# Altium project BoardCongSuat.PrjPcb
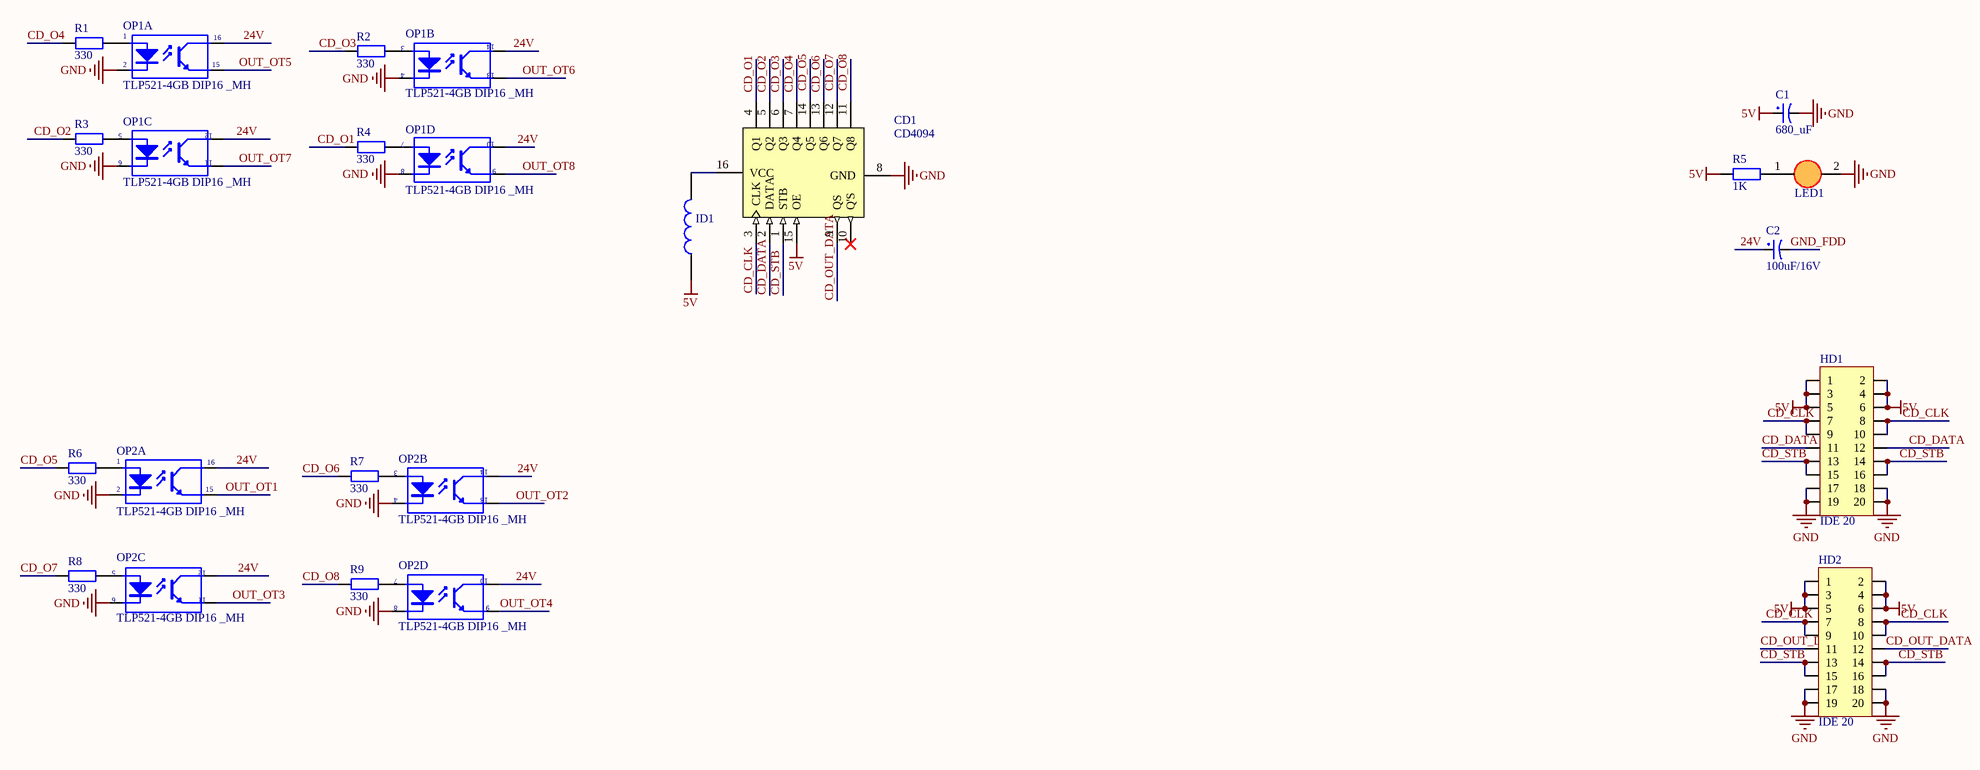
[diagram p0: CongSuat_SCH.SchDoc]
2 sheets, 87 parts. Net scope: global (net labels, ports and power ports of the same name join across sheets).
Board file: CS_PCB.PcbDoc
Sheets:
  CongSuat_SCH.SchDoc
  relay.SchDoc

## Sheet CongSuat_SCH.SchDoc
size A3

### Parts
C1  680_uF  [TU_HOA(100uF/35V - 470uF/16V)]
C2  100uF/16V  [TU_HOA(100uF/35V - 470uF/16V)]
CD1  CD4094  [DIP16]
HD1  IDE 20  [CABLE 20]
HD2  IDE 20  [CABLE 20]
ID1  Inductor 0805_MH  [TU_SMD_0805]  (value not drawn)
LED1  LED3  [LED 3mm Do]  (value not drawn)
OP1  TLP521-4GB DIP16 _MH  [DIP16]  (parts A,B,C,D of 4)
OP2  TLP521-4GB DIP16 _MH  [DIP16]  (parts A,B,C,D of 4)
R1  330  [Tro SMD 0805]
R2  330  [Tro SMD 0805]
R3  330  [Tro SMD 0805]
R4  330  [Tro SMD 0805]
R5  1K  [Tro SMD 0805]
R6  330  [Tro SMD 0805]
R7  330  [Tro SMD 0805]
R8  330  [Tro SMD 0805]
R9  330  [Tro SMD 0805]

### Nets
5V: C1.1 CD1.15(OE) HD1.1 HD1.2 HD1.3 HD1.4 HD1.5 HD1.6 HD2.1 HD2.2 HD2.3 HD2.4 HD2.5 HD2.6 ID1.1 R5.1
GND: C1.2 CD1.8(GND) HD1.17 HD1.18 HD1.19 HD1.20 HD2.17 HD2.18 HD2.19 HD2.20 LED1.2(K) OP1.2(K) OP1.4(K) OP1.6(K) OP1.8(K) OP2.2(K) OP2.4(K) OP2.6(K) OP2.8(K)
GND_FDD: C2.2
24V: C2.1 OP1.10(C) OP1.12(C) OP1.14(C) OP1.16(C) OP2.10(C) OP2.12(C) OP2.14(C) OP2.16(C)
CD_CLK: CD1.3(CLK) HD1.7 HD1.8 HD1.9 HD1.10 HD2.7 HD2.8 HD2.9 HD2.10
CD_DATA: CD1.2(DATA) HD1.11 HD1.12
CD_O1: CD1.4(Q1) R4.1
CD_O2: CD1.5(Q2) R3.1
CD_O3: CD1.6(Q3) R2.1
CD_O4: CD1.7(Q4) R1.1
CD_O5: CD1.14(Q5) R6.1
CD_O6: CD1.13(Q6) R7.1
CD_O7: CD1.12(Q7) R8.1
CD_O8: CD1.11(Q8) R9.1
CD_OUT_DATA: CD1.9(QS) HD2.11 HD2.12
CD_STB: CD1.1(STB) HD1.13 HD1.14 HD1.15 HD1.16 HD2.13 HD2.14 HD2.15 HD2.16
OUT_OT1: OP2.15(E)
OUT_OT2: OP2.13(E)
OUT_OT3: OP2.11(E)
OUT_OT4: OP2.9(E)
OUT_OT5: OP1.15(E)
OUT_OT6: OP1.13(E)
OUT_OT7: OP1.11(E)
OUT_OT8: OP1.9(E)
NetCD1_16: CD1.16(VCC) ID1.2
NetLED1_1: LED1.1(A) R5.2
NetOP1_1: OP1.1(A) R1.2
NetOP1_3: OP1.3(A) R2.2
NetOP1_5: OP1.5(A) R3.2
NetOP1_7: OP1.7(A) R4.2
NetOP2_1: OP2.1(A) R6.2
NetOP2_3: OP2.3(A) R7.2
NetOP2_5: OP2.5(A) R8.2
NetOP2_7: OP2.7(A) R9.2

Not connected (* = marked no-connect by the designer): CD1 10(Q'S)*

### Notes on the sheet
- Title
- Size:
- Date:
- A3
- Number:
- Time:
- Revision:
- Sheet
- of
- File:

### Library data of the parts
C1 = TU_HOA_680_uF_25V_MH: TU_HOA_680_uF_25V; Value: 100uF/35V/50V; Description 1: 1000uF/6,3V - 470uF/16V - 330uF - 25V; Description 2: 220uF/35V - 100uF/50V - 63V - 4,7uF/200V; Description 3: 22uF => 33uF100V - 3,3uF => 4,7uF/250V; Description 4: 2,2uF =>3,3uF/350 - 2,2uF/400V - 1uF/450V
C2 = TU_HOA_100uF_50V_MH: TU_HOA_100uF_50V; Value: 100uF/35V/50V; Description 1: 1000uF/6,3V - 470uF/16V - 330uF - 25V; Description 2: 220uF/35V - 100uF/50V - 63V - 4,7uF/200V; Description 3: 22uF => 33uF100V - 3,3uF => 4,7uF/250V; Description 4: 2,2uF =>3,3uF/350 - 2,2uF/400V - 1uF/450V
HD1 HD2 = IDE 20: IDE header 20P
ID1 = Inductor 0805_MH: cuon cam 0805
LED1 = LED 3mm_MH: LED 3mm
R1-R9 = TRO_SMD_0805_MH: TRO_SMD_0805
OP1 OP2 = TLP521-4GB DIP16 _MH: Value: TLP521-4

## Sheet relay.SchDoc
size A3
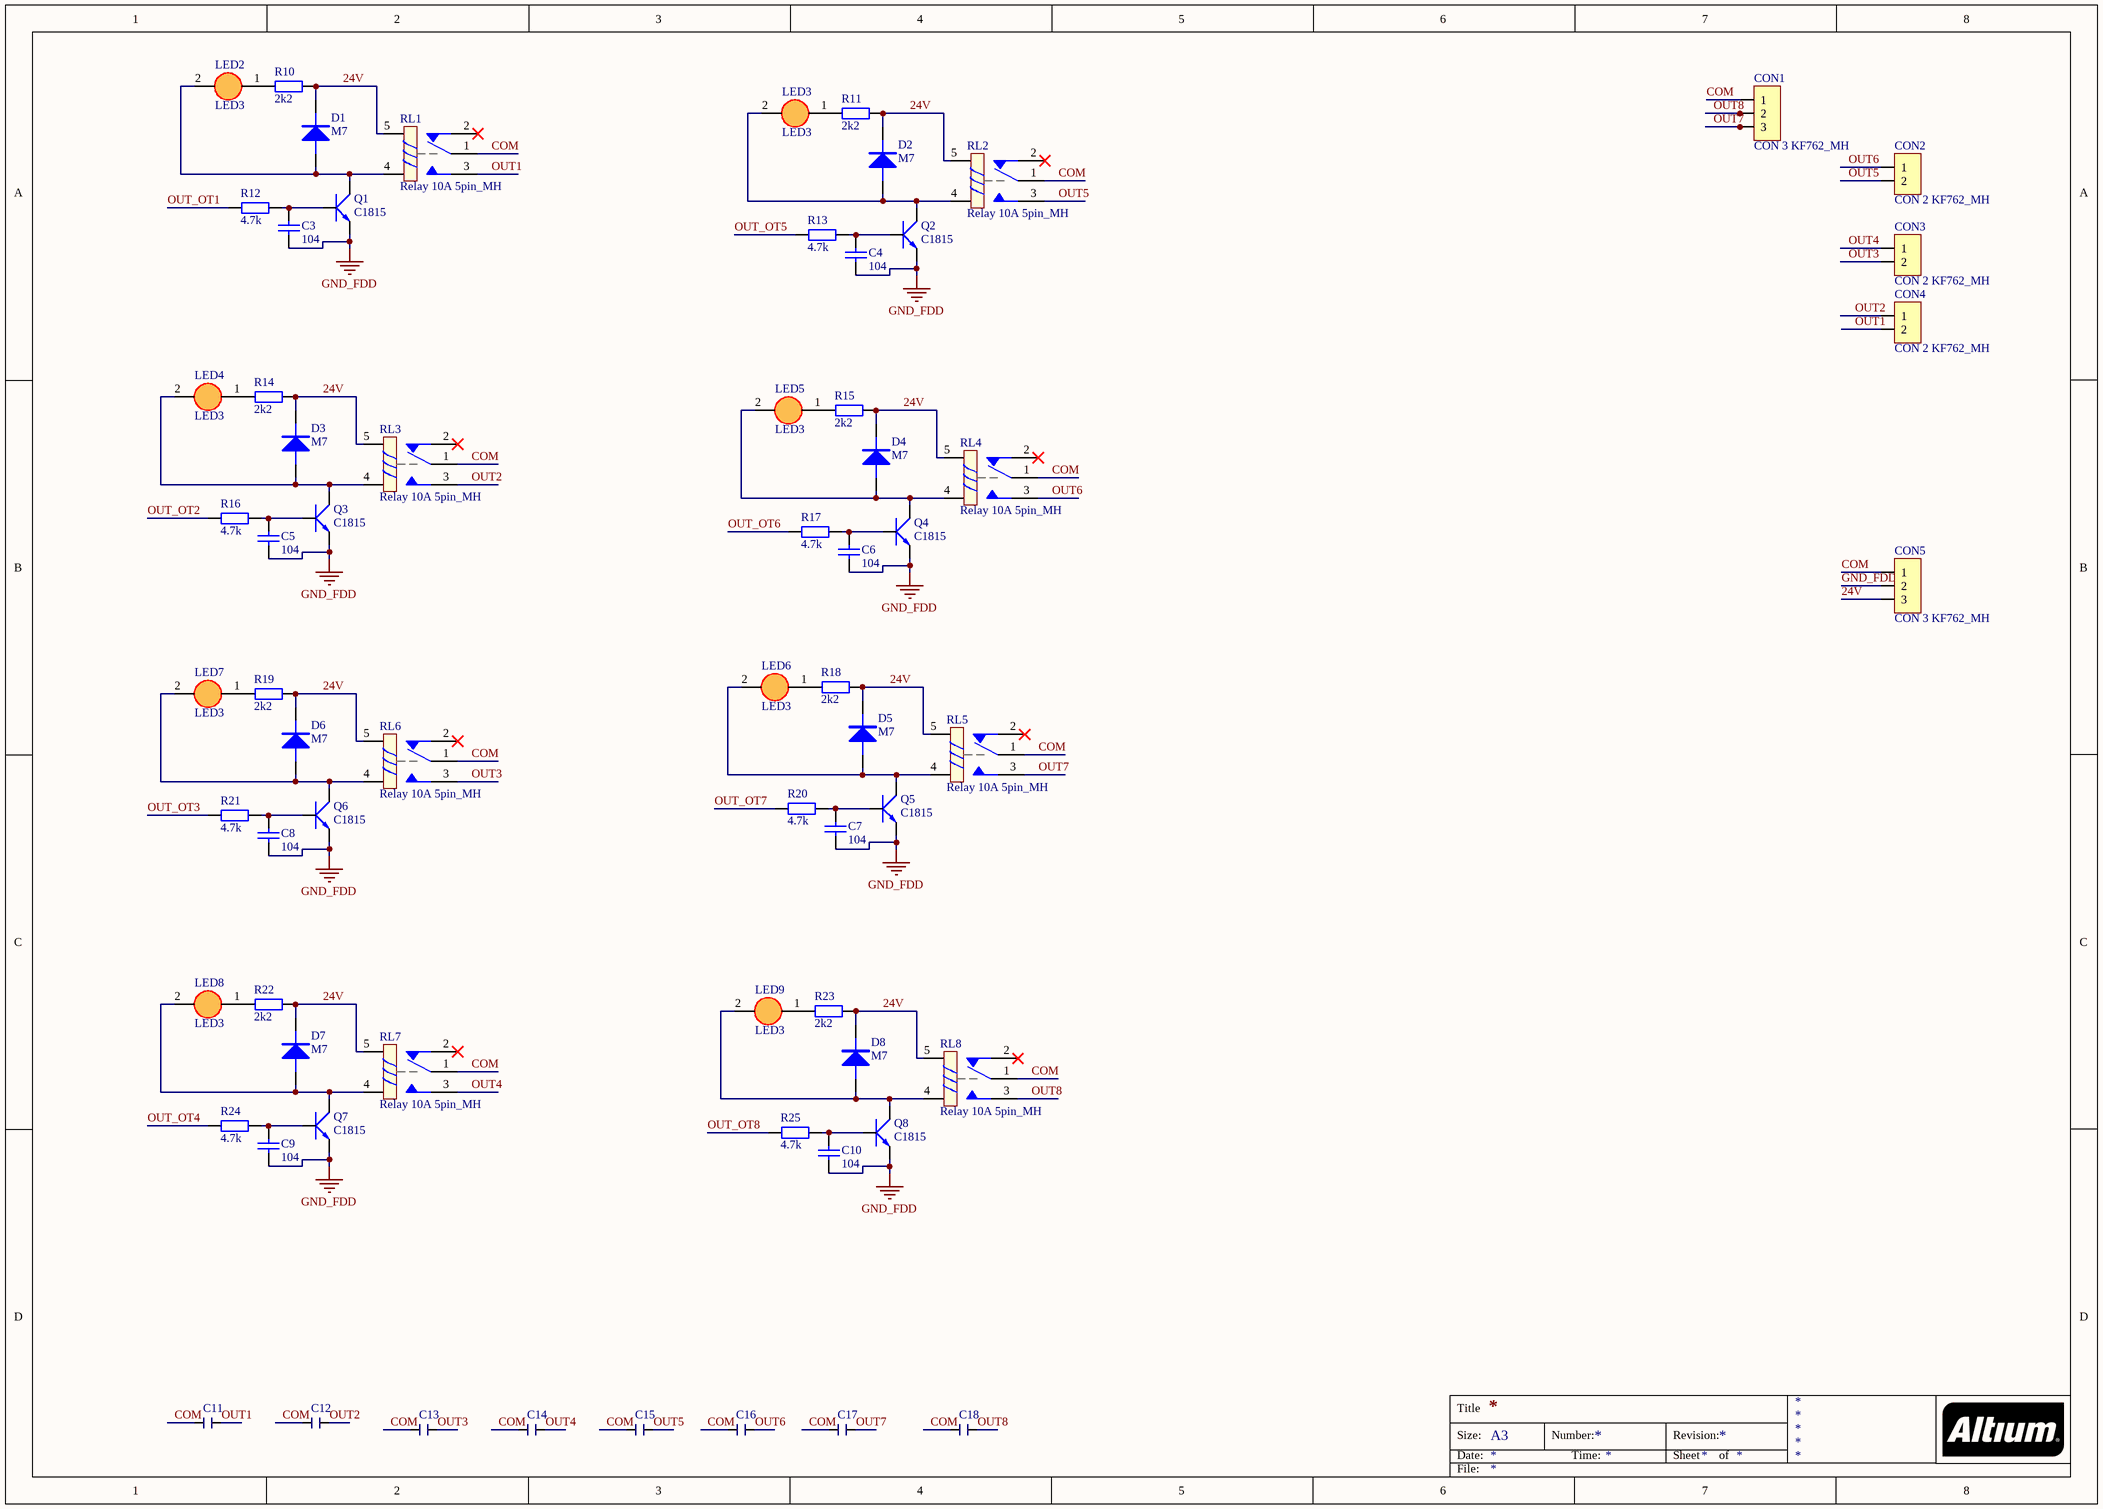
[diagram p1: relay.SchDoc]

### Parts
C3  104  [TU_SMD_0805]
C4  104  [TU_SMD_0805]
C5  104  [TU_SMD_0805]
C6  104  [TU_SMD_0805]
C7  104  [TU_SMD_0805]
C8  104  [TU_SMD_0805]
C9  104  [TU_SMD_0805]
C10  104  [TU_SMD_0805]
C11  TU_CAO__AP_103_102_101_1KV_MH  [TU_TATA_5.08]  (value not drawn)
C12  TU_CAO__AP_103_102_101_1KV_MH  [TU_TATA_5.08]  (value not drawn)
C13  TU_CAO__AP_103_102_101_1KV_MH  [TU_TATA_5.08]  (value not drawn)
C14  TU_CAO__AP_103_102_101_1KV_MH  [TU_TATA_5.08]  (value not drawn)
C15  TU_CAO__AP_103_102_101_1KV_MH  [TU_TATA_5.08]  (value not drawn)
C16  TU_CAO__AP_103_102_101_1KV_MH  [TU_TATA_5.08]  (value not drawn)
C17  TU_CAO__AP_103_102_101_1KV_MH  [TU_TATA_5.08]  (value not drawn)
C18  TU_CAO__AP_103_102_101_1KV_MH  [TU_TATA_5.08]  (value not drawn)
CON1  CON 3 KF762_MH  [Con 3 KF762]
CON2  CON 2 KF762_MH  [Con 2 KF762]
CON3  CON 2 KF762_MH  [Con 2 KF762]
CON4  CON 2 KF762_MH  [Con 2 KF762]
CON5  CON 3 KF762_MH  [Con 3 KF762]
D1  M7  [SOD80]
D2  M7  [SOD80]
D3  M7  [SOD80]
D4  M7  [SOD80]
D5  M7  [SOD80]
D6  M7  [SOD80]
D7  M7  [SOD80]
D8  M7  [SOD80]
LED2  LED3  [LED 3mm Do]
LED3  LED3  [LED 3mm Do]
LED4  LED3  [LED 3mm Do]
LED5  LED3  [LED 3mm Do]
LED6  LED3  [LED 3mm Do]
LED7  LED3  [LED 3mm Do]
LED8  LED3  [LED 3mm Do]
LED9  LED3  [LED 3mm Do]
Q1  C1815  [SOT23]
Q2  C1815  [SOT23]
Q3  C1815  [SOT23]
Q4  C1815  [SOT23]
Q5  C1815  [SOT23]
Q6  C1815  [SOT23]
Q7  C1815  [SOT23]
Q8  C1815  [SOT23]
R10  2k2  [Tro SMD 0805]
R11  2k2  [Tro SMD 0805]
R12  4.7k  [Tro SMD 0805]
R13  4.7k  [Tro SMD 0805]
R14  2k2  [Tro SMD 0805]
R15  2k2  [Tro SMD 0805]
R16  4.7k  [Tro SMD 0805]
R17  4.7k  [Tro SMD 0805]
R18  2k2  [Tro SMD 0805]
R19  2k2  [Tro SMD 0805]
R20  4.7k  [Tro SMD 0805]
R21  4.7k  [Tro SMD 0805]
R22  2k2  [Tro SMD 0805]
R23  2k2  [Tro SMD 0805]
R24  4.7k  [Tro SMD 0805]
R25  4.7k  [Tro SMD 0805]
RL1  Relay 10A 5pin_MH  [relay 10A 5pin]
RL2  Relay 10A 5pin_MH  [relay 10A 5pin]
RL3  Relay 10A 5pin_MH  [relay 10A 5pin]
RL4  Relay 10A 5pin_MH  [relay 10A 5pin]
RL5  Relay 10A 5pin_MH  [relay 10A 5pin]
RL6  Relay 10A 5pin_MH  [relay 10A 5pin]
RL7  Relay 10A 5pin_MH  [relay 10A 5pin]
RL8  Relay 10A 5pin_MH  [relay 10A 5pin]

### Nets
GND_FDD: C3.1 C4.1 C5.1 C6.1 C7.1 C8.1 C9.1 C10.1 CON5.2 Q1.2(E) Q2.2(E) Q3.2(E) Q4.2(E) Q5.2(E) Q6.2(E) Q7.2(E) Q8.2(E)
24V: CON5.3 D1.2 D2.2 D3.2 D4.2 D5.2 D6.2 D7.2 D8.2 R10.2 R11.2 R14.2 R15.2 R18.2 R19.2 R22.2 R23.2 RL1.5 RL2.5 RL3.5 RL4.5 RL5.5 RL6.5 RL7.5 RL8.5
COM: C11.1 C12.1 C13.1 C14.1 C15.1 C16.1 C17.1 C18.1 CON1.1 CON5.1 RL1.1 RL2.1 RL3.1 RL4.1 RL5.1 RL6.1 RL7.1 RL8.1
OUT1: C11.2 CON4.2 RL1.3
OUT2: C12.2 CON4.1 RL3.3
OUT3: C13.2 CON3.2 RL6.3
OUT4: C14.2 CON3.1 RL7.3
OUT5: C15.2 CON2.2 RL2.3
OUT6: C16.2 CON2.1 RL4.3
OUT7: C17.2 CON1.3 RL5.3
OUT8: C18.2 CON1.2 RL8.3
OUT_OT1: R12.1
OUT_OT2: R16.1
OUT_OT3: R21.1
OUT_OT4: R24.1
OUT_OT5: R13.1
OUT_OT6: R17.1
OUT_OT7: R20.1
OUT_OT8: R25.1
NetC3_2: C3.2 Q1.1(B) R12.2
NetC4_2: C4.2 Q2.1(B) R13.2
NetC5_2: C5.2 Q3.1(B) R16.2
NetC6_2: C6.2 Q4.1(B) R17.2
NetC7_2: C7.2 Q5.1(B) R20.2
NetC8_2: C8.2 Q6.1(B) R21.2
NetC9_2: C9.2 Q7.1(B) R24.2
NetC10_2: C10.2 Q8.1(B) R25.2
NetD1_1: D1.1 LED2.2(K) Q1.3(C) RL1.4
NetD2_1: D2.1 LED3.2(K) Q2.3(C) RL2.4
NetD3_1: D3.1 LED4.2(K) Q3.3(C) RL3.4
NetD4_1: D4.1 LED5.2(K) Q4.3(C) RL4.4
NetD5_1: D5.1 LED6.2(K) Q5.3(C) RL5.4
NetD6_1: D6.1 LED7.2(K) Q6.3(C) RL6.4
NetD7_1: D7.1 LED8.2(K) Q7.3(C) RL7.4
NetD8_1: D8.1 LED9.2(K) Q8.3(C) RL8.4
NetLED2_1: LED2.1(A) R10.1
NetLED3_1: LED3.1(A) R11.1
NetLED4_1: LED4.1(A) R14.1
NetLED5_1: LED5.1(A) R15.1
NetLED6_1: LED6.1(A) R18.1
NetLED7_1: LED7.1(A) R19.1
NetLED8_1: LED8.1(A) R22.1
NetLED9_1: LED9.1(A) R23.1

Not connected (* = marked no-connect by the designer): RL1 2*; RL2 2*; RL3 2*; RL4 2*; RL5 2*; RL6 2*; RL7 2*; RL8 2*

### Notes on the sheet
- Title
- Size:
- Date:
- A3
- Number:
- Time:
- Revision:
- Sheet
- of
- File:

### Library data of the parts
C3-C10 = TU_SMD_0805_MH
C11-C18 = TU_CAO__AP_103_102_101_1KV_MH: 103 1KV
CON1 CON5 = CON 3 KF762_MH: CON 3 KF762 - 3P 7.62mm
CON2-CON4 = CON 2 KF762_MH: CON 2 KF762 - 2P 7.62mm
D1-D8 = Diode 1N4148 SOD80 450mA 100V ( LL34 1N4148 SMD)_MH: Diode 1N4148 SOD80 450mA 100V ( LL34 1N4148 SMD)
LED2-LED9 = LED 3mm_MH: LED 3mm
Q1-Q8 = C1815 SOT23 TRANS NPN 0.15A 50V (SMD-HF)_MH
R10-R25 = TRO_SMD_0805_MH: TRO_SMD_0805
RL1-RL8 = Relay 10A 5pin_MH: Relay

## Nets that join several sheets
GND_FDD: CongSuat_SCH (C2.2), relay (17 pins)
24V: CongSuat_SCH (9 pins), relay (25 pins)
OUT_OT1: CongSuat_SCH (OP2.15), relay (R12.1)
OUT_OT2: CongSuat_SCH (OP2.13), relay (R16.1)
OUT_OT3: CongSuat_SCH (OP2.11), relay (R21.1)
OUT_OT4: CongSuat_SCH (OP2.9), relay (R24.1)
OUT_OT5: CongSuat_SCH (OP1.15), relay (R13.1)
OUT_OT6: CongSuat_SCH (OP1.13), relay (R17.1)
OUT_OT7: CongSuat_SCH (OP1.11), relay (R20.1)
OUT_OT8: CongSuat_SCH (OP1.9), relay (R25.1)